# Altium schematic sheet bmsSlave_main.SchDoc
size B; SheetNumber: 2; SheetTotal: 4; Designator: R
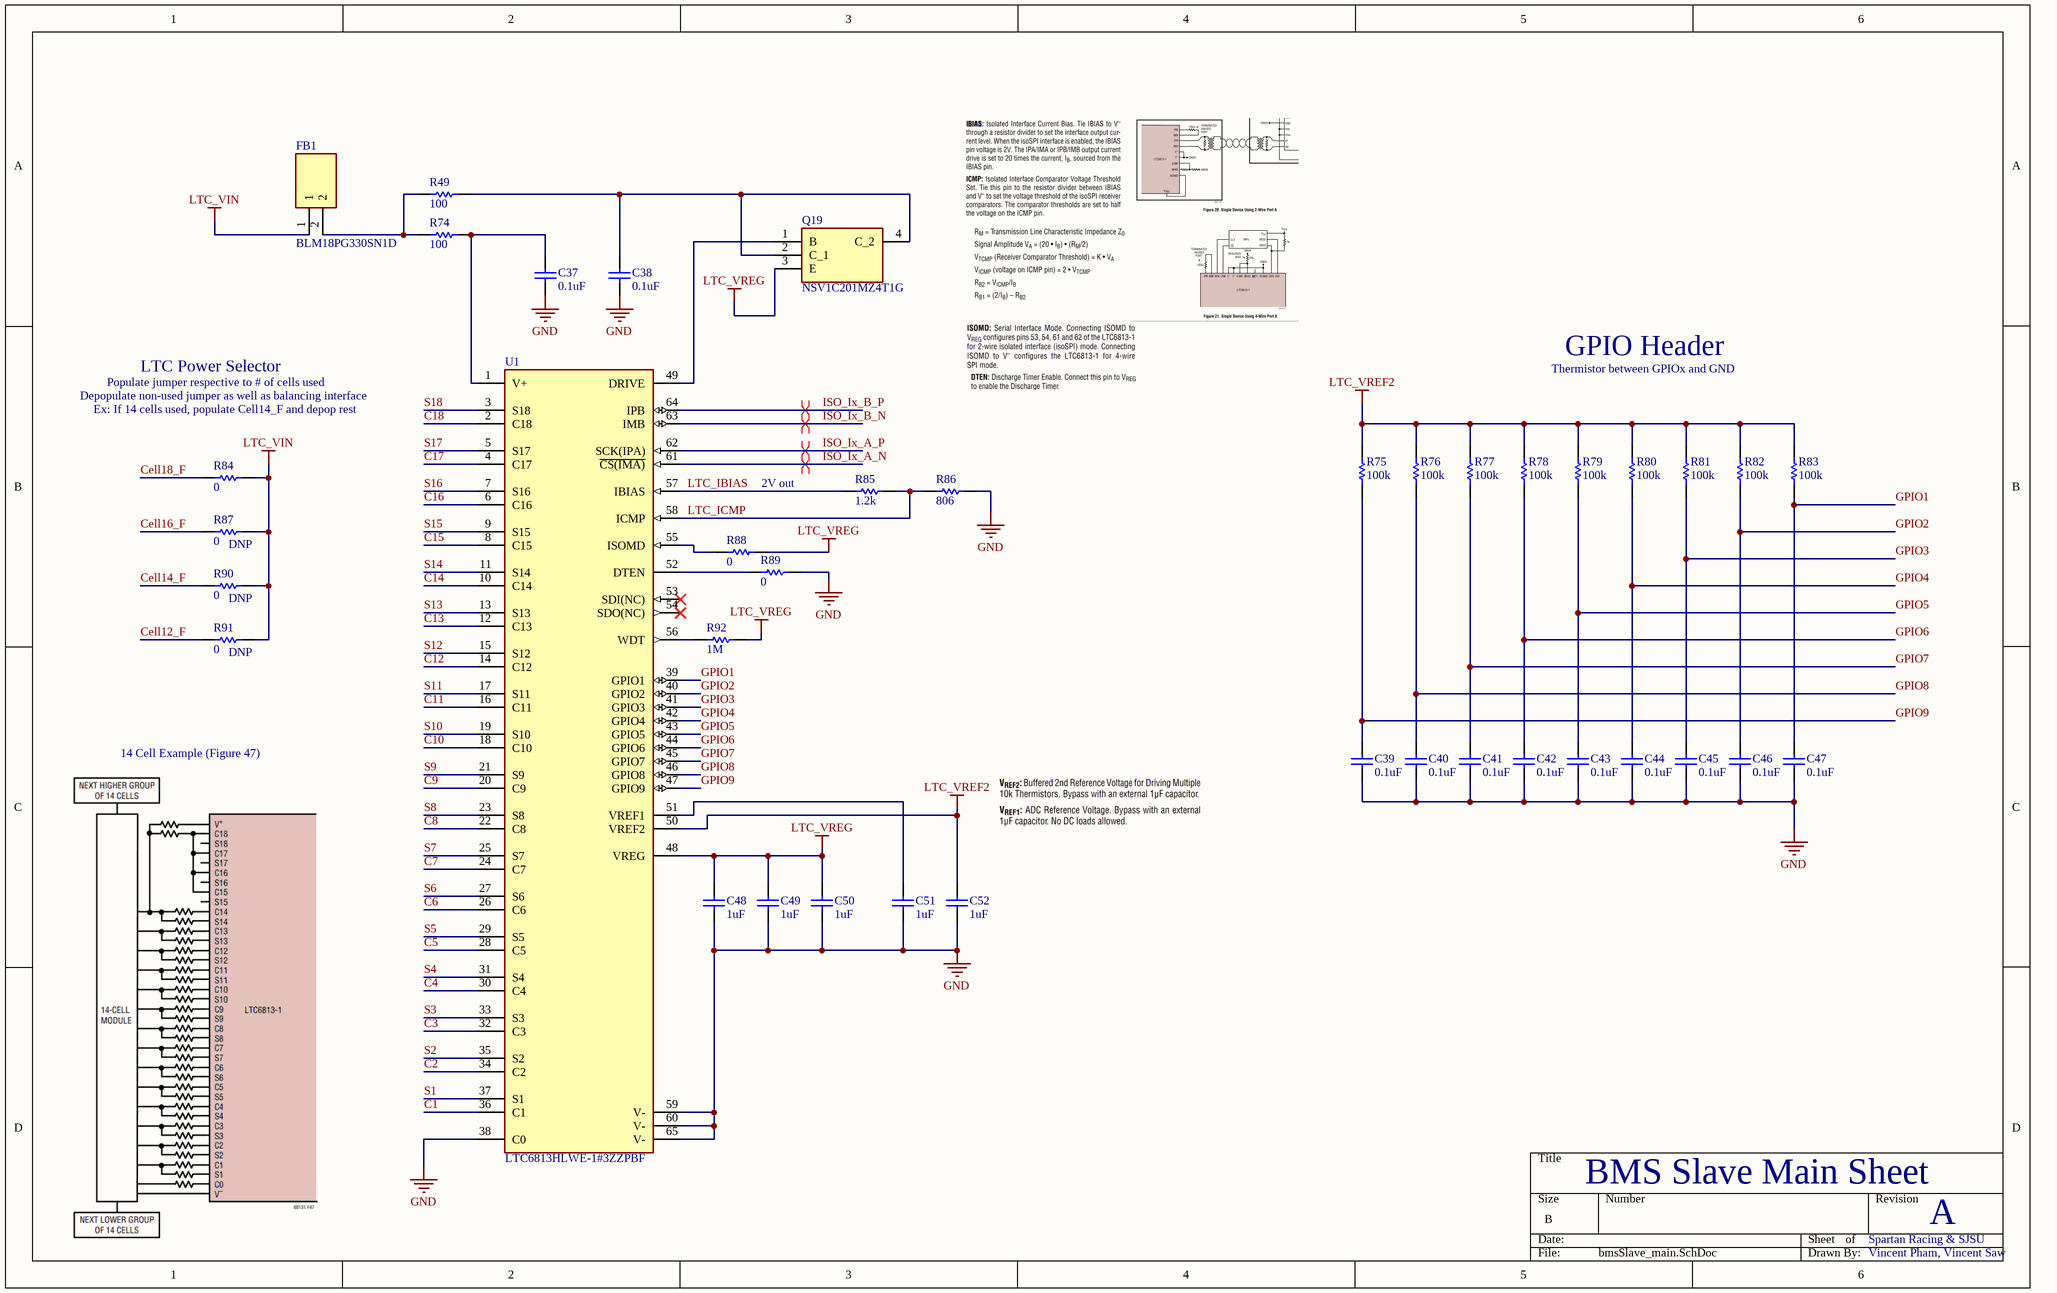
[diagram p0: bmsSlave_main.SchDoc]

## Parts
C37  value 0.1uF  [C0603]  (hidden comment: Capacitor)
C38  value 0.1uF  [C0603]  (hidden comment: Capacitor)
C39  value 0.1uF  [C0603]  (hidden comment: Capacitor)
C40  value 0.1uF  [C0603]  (hidden comment: Capacitor)
C41  value 0.1uF  [C0603]  (hidden comment: Capacitor)
C42  value 0.1uF  [C0603]  (hidden comment: Capacitor)
C43  value 0.1uF  [C0603]  (hidden comment: Capacitor)
C44  value 0.1uF  [C0603]  (hidden comment: Capacitor)
C45  value 0.1uF  [C0603]  (hidden comment: Capacitor)
C46  value 0.1uF  [C0603]  (hidden comment: Capacitor)
C47  value 0.1uF  [C0603]  (hidden comment: Capacitor)
C48  value 1uF  [C0603]  (hidden comment: Capacitor)
C49  value 1uF  [C0603]  (hidden comment: Capacitor)
C50  value 1uF  [C0603]  (hidden comment: Capacitor)
C51  value 1uF  [C0603]  (hidden comment: Capacitor)
C52  value 1uF  [C0603]  (hidden comment: Capacitor)
FB1  BLM18PG330SN1D  [BEADC1608X95N]
Q19  NSV1C201MZ4T1G  [SOT230P700X175-4N]
R49  value 100  [R0603]  (hidden comment: Resistor)
R74  value 100  [R0603]  (hidden comment: Resistor)
R75  value 100k  [R0603]  (hidden comment: Resistor)
R76  value 100k  [R0603]  (hidden comment: Resistor)
R77  value 100k  [R0603]  (hidden comment: Resistor)
R78  value 100k  [R0603]  (hidden comment: Resistor)
R79  value 100k  [R0603]  (hidden comment: Resistor)
R80  value 100k  [R0603]  (hidden comment: Resistor)
R81  value 100k  [R0603]  (hidden comment: Resistor)
R82  value 100k  [R0603]  (hidden comment: Resistor)
R83  value 100k  [R0603]  (hidden comment: Resistor)
R84  value 0  [R0603]  (hidden comment: Resistor)
R85  value 1.2k  [R0603]  (hidden comment: Resistor)
R86  value 806  [R0603]  (hidden comment: Resistor)
R87  value 0  [R0603]  (hidden comment: Resistor)
R88  value 0  [R0603]  (hidden comment: Resistor)
R89  value 0  [R0603]  (hidden comment: Resistor)
R90  value 0  [R0603]  (hidden comment: Resistor)
R91  value 0  [R0603]  (hidden comment: Resistor)
R92  value 1M  [R0603]  (hidden comment: Resistor)
U1  LTC6813HLWE-1#3ZZPBF  [FP-LWE-64-05-08-1982-MFG]

## Nets
GND: C37.2 C38.2 C39.2 C40.2 C41.2 C42.2 C43.2 C44.2 C45.2 C46.2 C47.2 C48.2 C49.2 C50.2 C51.2 C52.2 R86.2 R89.1 U1.38(C0) U1.59(V-) U1.60(V-) U1.65(V-)
LTC_VIN: FB1.1 R84.2 R87.2 R90.2 R91.2
LTC_VREF2: C52.1 R75.2 R76.2 R77.2 R78.2 R79.2 R80.2 R81.2 R82.2 R83.2 U1.50(VREF2)
LTC_VREG: C48.1 C49.1 C50.1 Q19.3(E) R88.1 R92.1 U1.48(VREG)
C1: U1.36(C1)
C2: U1.34(C2)
C3: U1.32(C3)
C4: U1.30(C4)
C5: U1.28(C5)
C6: U1.26(C6)
C7: U1.24(C7)
C8: U1.22(C8)
C9: U1.20(C9)
C10: U1.18(C10)
C11: U1.16(C11)
C12: U1.14(C12)
C13: U1.12(C13)
C14: U1.10(C14)
C15: U1.8(C15)
C16: U1.6(C16)
C17: U1.4(C17)
C18: U1.2(C18)
Cell12_F: R91.1
Cell14_F: R90.1
Cell16_F: R87.1
Cell18_F: R84.1
GPIO1: C47.1 R83.1 U1.39(GPIO1)
GPIO2: C46.1 R82.1 U1.40(GPIO2)
GPIO3: C45.1 R81.1 U1.41(GPIO3)
GPIO4: C44.1 R80.1 U1.42(GPIO4)
GPIO5: C43.1 R79.1 U1.43(GPIO5)
GPIO6: C42.1 R78.1 U1.44(GPIO6)
GPIO7: C41.1 R77.1 U1.45(GPIO7)
GPIO8: C40.1 R76.1 U1.46(GPIO8)
GPIO9: C39.1 R75.1 U1.47(GPIO9)
ISO_Ix_A_N: U1.61(~{CS(IMA)})
ISO_Ix_A_P: U1.62(SCK(IPA))
ISO_Ix_B_N: U1.63(IMB)
ISO_Ix_B_P: U1.64(IPB)
LTC_IBIAS: R85.2 U1.57(IBIAS)
LTC_ICMP: R85.1 R86.1 U1.58(ICMP)
S1: U1.37(S1)
S2: U1.35(S2)
S3: U1.33(S3)
S4: U1.31(S4)
S5: U1.29(S5)
S6: U1.27(S6)
S7: U1.25(S7)
S8: U1.23(S8)
S9: U1.21(S9)
S10: U1.19(S10)
S11: U1.17(S11)
S12: U1.15(S12)
S13: U1.13(S13)
S14: U1.11(S14)
S15: U1.9(S15)
S16: U1.7(S16)
S17: U1.5(S17)
S18: U1.3(S18)
NetC37_1: C37.1 R74.2 U1.1(V+)
NetC38_1: C38.1 Q19.2(C_1) Q19.4(C_2) R49.2
NetC51_1: C51.1 U1.51(VREF1)
NetFB1_2: FB1.2 R49.1 R74.1
NetQ19_1: Q19.1(B) U1.49(DRIVE)
NetR88_2: R88.2 U1.55(ISOMD)
NetR89_2: R89.2 U1.52(DTEN)
NetR92_2: R92.2 U1.56(WDT)

Not connected (* = marked no-connect by the designer): U1 53(SDI(NC))* 54(SDO(NC))*

## Layout directives
differential pair: ISO_Ix_A_N, ISO_Ix_A_P, ISO_Ix_B_N, ISO_Ix_B_P

## Notes on the sheet
- LTC Power Selector
- Thermistor between GPIOx and GND
- GPIO Header
- Depopulate non-used jumper as well as balancing interface
- Ex: If 14 cells used, populate Cell14_F and depop rest
- Populate jumper respective to # of cells used
- 2V out
- (near R87) DNP
- (near R90) DNP
- (near R91) DNP
- 14 Cell Example (Figure 47)
- BMS Slave Main Sheet
- Spartan Racing & SJSU
- A
- Vincent Pham, Vincent Saw

## Library data of the parts
C37-C52 = Capacitor: SimulationGenericComponent: True
FB1 = BLM18PG330SN1D: Ferrite Bead; Manufacturer_Name: Murata Electronics; Datasheet Link: http://www.murata.com/~/media/webrenewal/support/library/catalog/products/emc/emifil/c31e.ashx?la=en-gb; Height: 0.95mm; Manufacturer_Part_Number: BLM18PG330SN1D; Mouser Part Number: 81-BLM18PG330SN1D; Mouser Price/Stock: https://www.mouser.co.uk/ProductDetail/Murata-Electronics/BLM18PG330SN1D?qs=4Avc3lXqH4bdltMAIp8Scg%3D%3D; Arrow Part Number: BLM18PG330SN1D; Arrow Price/Stock: https://www.arrow.com/en/products/blm18pg330sn1d/murata-manufacturing?region=nac
Q19 = NSV1C201MZ4T1G: Transistor; Manufacturer_Name: onsemi; Datasheet Link: http://www.onsemi.com/pub/Collateral/NSS1C201MZ4-D.PDF; Height: 1.75mm; Manufacturer_Part_Number: NSV1C201MZ4T1G; Mouser Part Number: 863-NSV1C201MZ4T1G; Mouser Price/Stock: https://www.mouser.co.uk/ProductDetail/onsemi/NSV1C201MZ4T1G?qs=abmNkq9no6CNkkQTLXtvJQ%3D%3D; Arrow Part Number: NSV1C201MZ4T1G; Arrow Price/Stock: https://www.arrow.com/en/products/nsv1c201mz4t1g/on-semiconductor
R49 R74-R83 R85 R86 R92 = Resistor: TC1: 0; SimulationGenericComponent: True; TC2: 0
R84 R87-R91 = Resistor: SimulationGenericComponent: True; TC1: 0; TC2: 0
U1 = CMP-09132-000002-1: 18 CHANNEL MULTICELL BATTERY STA; Manufacturer: Analog Devices; Number Of Outputs: 1; Min Supply Voltage: 2.7V; Max Junction Temp: +125°C; Number Of Cells: 18; Output Voltage: 5.7V; Standoff Height: 0.05mm; Nominal Supply Current: 3-6.1uA; Automotive Grade: Grade 1; Max Supply Voltage: 3.6V; Temperature: -40°C to +125°C; Temperature Range Low: -40°C; Lead Free: Yes; Device Class L1: Integrated Circuits (ICs); ComponentLink2Description: Datasheet; ComponentLink2URL: https://www.analog.com/media/en/technical-documentation/data-sheets/LTC6813-1.pdf; Height: 1.6mm; Package: LWE-64-05-08-1982; Digikey Description: 18 CHANNEL MULTICELL BATTERY STA; RoHS: TRUE; Category: IC; Octopart: https://octopart.com/ltc6813hlwe-1%233zzpbf-analog+devices-90390400; Temperature Range High: +125°C; Automotive: Yes; Manufacturer Part Number: LTC6813HLWE-1#3ZZPBF; Device Class L3: Battery Management; Device Class L2: Power Management ICs; Ipc Land Pattern Name: QFP50P1200X1200X160-64